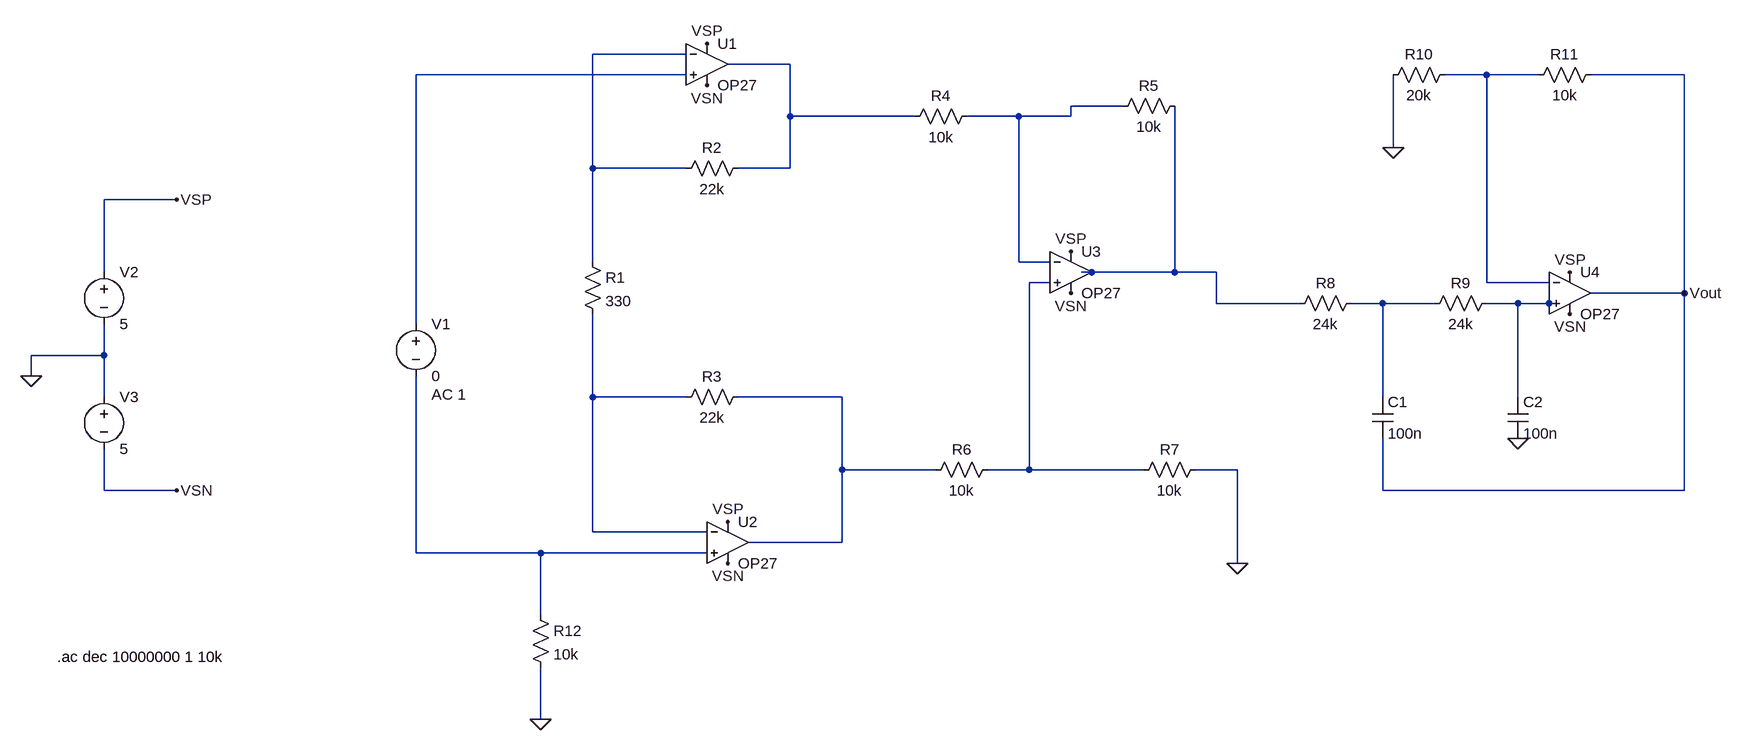
[diagram p0: schematic Bonus - Cerinta 3.asc]
Bonus - Cerinta 3.asc, the LTspice schematic file:
Version 4
SHEET 1 2448 804
WIRE 864 -240 720 -240
WIRE 1024 -224 928 -224
WIRE 864 -208 448 -208
WIRE 2096 -208 2032 -208
WIRE 2176 -208 2096 -208
WIRE 2400 -208 2256 -208
WIRE 1536 -160 1456 -160
WIRE 1024 -144 1024 -224
WIRE 1216 -144 1024 -144
WIRE 1376 -144 1296 -144
WIRE 1456 -144 1456 -160
WIRE 1456 -144 1376 -144
WIRE 1952 -96 1952 -208
WIRE 720 -64 720 -240
WIRE 864 -64 720 -64
WIRE 1024 -64 1024 -144
WIRE 1024 -64 944 -64
WIRE 80 -16 -32 -16
WIRE 720 80 720 -64
WIRE 1376 80 1376 -144
WIRE 1424 80 1376 80
WIRE -32 96 -32 -16
WIRE 1488 96 1472 96
WIRE 1616 96 1616 -160
WIRE 1616 96 1488 96
WIRE 1680 96 1616 96
WIRE 1424 112 1392 112
WIRE 2096 112 2096 -208
WIRE 2192 112 2096 112
WIRE 2400 128 2400 -208
WIRE 2400 128 2256 128
WIRE 1680 144 1680 96
WIRE 1808 144 1680 144
WIRE 1936 144 1888 144
WIRE 2016 144 1936 144
WIRE 2144 144 2096 144
WIRE 2192 144 2144 144
WIRE 2208 144 2192 144
WIRE 448 176 448 -208
WIRE -32 224 -32 176
WIRE -32 224 -144 224
WIRE -144 256 -144 224
WIRE -32 288 -32 224
WIRE 720 288 720 160
WIRE 864 288 720 288
WIRE 1104 288 944 288
WIRE 1936 288 1936 144
WIRE 2144 288 2144 144
WIRE 1104 400 1104 288
WIRE 1248 400 1104 400
WIRE 1392 400 1392 112
WIRE 1392 400 1328 400
WIRE 1568 400 1392 400
WIRE 1712 400 1648 400
WIRE -32 432 -32 368
WIRE 80 432 -32 432
WIRE 1936 432 1936 352
WIRE 2400 432 2400 128
WIRE 2400 432 1936 432
WIRE 720 496 720 288
WIRE 896 496 720 496
WIRE 1104 512 1104 400
WIRE 1104 512 960 512
WIRE 448 528 448 256
WIRE 640 528 448 528
WIRE 896 528 640 528
WIRE 1712 544 1712 400
WIRE 640 624 640 528
WIRE 640 784 640 704
FLAG -144 256 0
FLAG 80 -16 VSP
FLAG 80 432 VSN
FLAG 640 784 0
FLAG 1712 544 0
FLAG 1952 -96 0
FLAG 2144 352 0
FLAG 2224 96 VSP
FLAG 2224 160 VSN
FLAG 1456 64 VSP
FLAG 1456 128 VSN
FLAG 896 -256 VSP
FLAG 896 -192 VSN
FLAG 2400 128 Vout
FLAG 928 480 VSP
FLAG 928 544 VSN
SYMBOL voltage -32 80 R0
SYMATTR InstName V2
SYMATTR Value 5
SYMBOL voltage -32 272 R0
SYMATTR InstName V3
SYMATTR Value 5
SYMBOL voltage 448 160 R0
WINDOW 123 24 124 Left 2
WINDOW 39 0 0 Left 2
SYMATTR Value2 AC 1
SYMATTR InstName V1
SYMATTR Value 0
SYMBOL res 624 608 R0
SYMATTR InstName R12
SYMATTR Value 10k
SYMBOL res 960 272 R90
WINDOW 0 0 56 VBottom 2
WINDOW 3 32 56 VTop 2
SYMATTR InstName R3
SYMATTR Value 22k
SYMBOL res 960 -80 R90
WINDOW 0 0 56 VBottom 2
WINDOW 3 32 56 VTop 2
SYMATTR InstName R2
SYMATTR Value 22k
SYMBOL res 704 64 R0
SYMATTR InstName R1
SYMATTR Value 330
SYMBOL res 1312 -160 R90
WINDOW 0 0 56 VBottom 2
WINDOW 3 32 56 VTop 2
SYMATTR InstName R4
SYMATTR Value 10k
SYMBOL res 1632 -176 R90
WINDOW 0 0 56 VBottom 2
WINDOW 3 32 56 VTop 2
SYMATTR InstName R5
SYMATTR Value 10k
SYMBOL res 1344 384 R90
WINDOW 0 0 56 VBottom 2
WINDOW 3 32 56 VTop 2
SYMATTR InstName R6
SYMATTR Value 10k
SYMBOL res 1664 384 R90
WINDOW 0 0 56 VBottom 2
WINDOW 3 32 56 VTop 2
SYMATTR InstName R7
SYMATTR Value 10k
SYMBOL res 1904 128 R90
WINDOW 0 0 56 VBottom 2
WINDOW 3 32 56 VTop 2
SYMATTR InstName R8
SYMATTR Value 24k
SYMBOL res 2112 128 R90
WINDOW 0 0 56 VBottom 2
WINDOW 3 32 56 VTop 2
SYMATTR InstName R9
SYMATTR Value 24k
SYMBOL cap 1920 288 R0
SYMATTR InstName C1
SYMATTR Value 100n
SYMBOL cap 2128 288 R0
SYMATTR InstName C2
SYMATTR Value 100n
SYMBOL res 2048 -224 R90
WINDOW 0 0 56 VBottom 2
WINDOW 3 32 56 VTop 2
SYMATTR InstName R10
SYMATTR Value 20k
SYMBOL res 2272 -224 R90
WINDOW 0 0 56 VBottom 2
WINDOW 3 32 56 VTop 2
SYMATTR InstName R11
SYMATTR Value 10k
SYMBOL Opamps\\OP27 896 -288 R0
SYMATTR InstName U1
SYMBOL Opamps\\OP27 928 448 R0
SYMATTR InstName U2
SYMBOL Opamps\\OP27 1456 32 R0
SYMATTR InstName U3
SYMBOL Opamps\\OP27 2224 64 R0
SYMATTR InstName U4
TEXT -104 688 Left 2 !.ac dec 10000000 1 10k

The netlist it stands for:
* Bonus - Cerinta 3.asc
V2 VSP 0 5
V3 0 VSN 5
V1 N003 N012 0 AC 1
R12 N012 0 10k
R3 N011 N010 22k
R2 N002 N001 22k
R1 N001 N010 330
R4 N005 N002 10k
R5 N006 N005 10k
R6 N007 N011 10k
R7 0 N007 10k
R8 N008 N006 24k
R9 N009 N008 24k
C1 N008 Vout 100n
C2 N009 0 100n
R10 N004 0 20k
R11 Vout N004 10k
XU1 N003 N001 VSP VSN N002 OP27  ; pins In+ In- V+ V- OUT
XU2 N012 N010 VSP VSN N011 OP27  ; pins In+ In- V+ V- OUT
XU3 N007 N005 VSP VSN N006 OP27  ; pins In+ In- V+ V- OUT
XU4 N009 N004 VSP VSN Vout OP27  ; pins In+ In- V+ V- OUT
.ac dec 10000000 1 10k
.lib ADI.lib
.backanno
.end